# EAGLE schematic Dawing Machine Rev 1 (EAGLE 6.4)
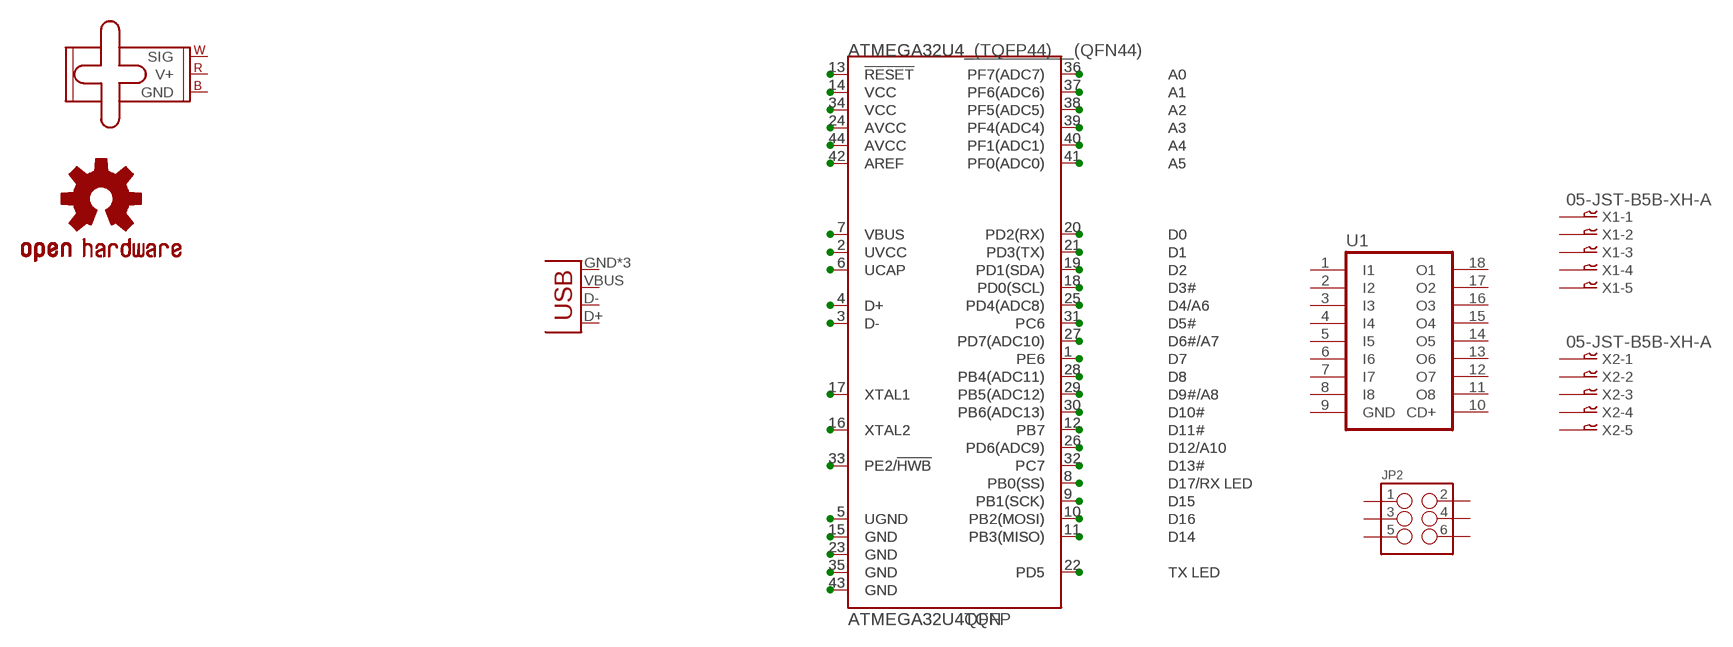
[diagram p0: schematic, sheet 1]

## Parts
ATMEGA32U4_(TQFP44)  ATMEGA32U4TQFP  [SPARKFUN-DIGITALIC_TQFP44]
ATMEGA32U4___________(QFN44)  ATMEGA32U4QFN  [SPARKFUN-DIGITALIC_QFN-44]
JP1  USB-MICROB  [USB-MICROB]
JP2  M03X2SMT  [2X3_SMT_POSTS]
LOGO1  OSHW-LOGOS  [OSHW-LOGO-S]
M1  SMALL_SERVO  [1X03]
U1  ULN2803AFW  [SO18W]
X1  05-JST-B5B-XH-A  [B5B-XH]
X2  05-JST-B5B-XH-A  [B5B-XH]

## Nets
N$1: ATMEGA32U4_(TQFP44).13(!RESET) ATMEGA32U4___________(QFN44).13(!RESET)
N$2: ATMEGA32U4_(TQFP44).42(AREF) ATMEGA32U4___________(QFN44).42(AREF)
N$3: ATMEGA32U4_(TQFP44).24(AVCC) ATMEGA32U4___________(QFN44).24(AVCC)
N$4: ATMEGA32U4_(TQFP44).44(AVCC) ATMEGA32U4___________(QFN44).44(AVCC)
N$5: ATMEGA32U4_(TQFP44).4(D+) ATMEGA32U4___________(QFN44).4(D+)
N$6: ATMEGA32U4_(TQFP44).3(D-) ATMEGA32U4___________(QFN44).3(D-)
N$7: ATMEGA32U4_(TQFP44).15(GND) ATMEGA32U4___________(QFN44).15(GND)
N$8: ATMEGA32U4_(TQFP44).23(GND) ATMEGA32U4___________(QFN44).23(GND)
N$9: ATMEGA32U4_(TQFP44).35(GND) ATMEGA32U4___________(QFN44).35(GND)
N$10: ATMEGA32U4_(TQFP44).43(GND) ATMEGA32U4___________(QFN44).43(GND)
N$11: ATMEGA32U4_(TQFP44).8(PB0(SS)) ATMEGA32U4___________(QFN44).8(PB0(SS))
N$12: ATMEGA32U4_(TQFP44).9(PB1(SCK)) ATMEGA32U4___________(QFN44).9(PB1(SCK))
N$13: ATMEGA32U4_(TQFP44).10(PB2(MOSI)) ATMEGA32U4___________(QFN44).10(PB2(MOSI))
N$14: ATMEGA32U4_(TQFP44).11(PB3(MISO)) ATMEGA32U4___________(QFN44).11(PB3(MISO))
N$15: ATMEGA32U4_(TQFP44).28(PB4(ADC11)) ATMEGA32U4___________(QFN44).28(PB4(ADC11))
N$16: ATMEGA32U4_(TQFP44).29(PB5(ADC12)) ATMEGA32U4___________(QFN44).29(PB5(ADC12))
N$17: ATMEGA32U4_(TQFP44).30(PB6(ADC13)) ATMEGA32U4___________(QFN44).30(PB6(ADC13))
N$18: ATMEGA32U4_(TQFP44).12(PB7) ATMEGA32U4___________(QFN44).12(PB7)
N$19: ATMEGA32U4_(TQFP44).31(PC6) ATMEGA32U4___________(QFN44).31(PC6)
N$20: ATMEGA32U4_(TQFP44).32(PC7) ATMEGA32U4___________(QFN44).32(PC7)
N$21: ATMEGA32U4_(TQFP44).18(PD0(SCL)) ATMEGA32U4___________(QFN44).18(PD0(SCL))
N$22: ATMEGA32U4_(TQFP44).19(PD1(SDA)) ATMEGA32U4___________(QFN44).19(PD1(SDA))
N$23: ATMEGA32U4_(TQFP44).20(PD2(RX)) ATMEGA32U4___________(QFN44).20(PD2(RX))
N$24: ATMEGA32U4_(TQFP44).21(PD3(TX)) ATMEGA32U4___________(QFN44).21(PD3(TX))
N$25: ATMEGA32U4_(TQFP44).25(PD4(ADC8)) ATMEGA32U4___________(QFN44).25(PD4(ADC8))
N$26: ATMEGA32U4_(TQFP44).22(PD5) ATMEGA32U4___________(QFN44).22(PD5)
N$27: ATMEGA32U4_(TQFP44).26(PD6(ADC9)) ATMEGA32U4___________(QFN44).26(PD6(ADC9))
N$28: ATMEGA32U4_(TQFP44).27(PD7(ADC10)) ATMEGA32U4___________(QFN44).27(PD7(ADC10))
N$29: ATMEGA32U4_(TQFP44).33(PE2/!HWB) ATMEGA32U4___________(QFN44).33(PE2/!HWB)
N$30: ATMEGA32U4_(TQFP44).1(PE6) ATMEGA32U4___________(QFN44).1(PE6)
N$31: ATMEGA32U4_(TQFP44).41(PF0(ADC0)) ATMEGA32U4___________(QFN44).41(PF0(ADC0))
N$32: ATMEGA32U4_(TQFP44).40(PF1(ADC1)) ATMEGA32U4___________(QFN44).40(PF1(ADC1))
N$33: ATMEGA32U4_(TQFP44).39(PF4(ADC4)) ATMEGA32U4___________(QFN44).39(PF4(ADC4))
N$34: ATMEGA32U4_(TQFP44).38(PF5(ADC5)) ATMEGA32U4___________(QFN44).38(PF5(ADC5))
N$35: ATMEGA32U4_(TQFP44).37(PF6(ADC6)) ATMEGA32U4___________(QFN44).37(PF6(ADC6))
N$36: ATMEGA32U4_(TQFP44).36(PF7(ADC7)) ATMEGA32U4___________(QFN44).36(PF7(ADC7))
N$37: ATMEGA32U4_(TQFP44).6(UCAP) ATMEGA32U4___________(QFN44).6(UCAP)
N$38: ATMEGA32U4_(TQFP44).5(UGND) ATMEGA32U4___________(QFN44).5(UGND)
N$39: ATMEGA32U4_(TQFP44).2(UVCC) ATMEGA32U4___________(QFN44).2(UVCC)
N$40: ATMEGA32U4_(TQFP44).7(VBUS) ATMEGA32U4___________(QFN44).7(VBUS)
N$41: ATMEGA32U4_(TQFP44).14(VCC) ATMEGA32U4___________(QFN44).14(VCC)
N$42: ATMEGA32U4_(TQFP44).34(VCC) ATMEGA32U4___________(QFN44).34(VCC)
N$43: ATMEGA32U4_(TQFP44).17(XTAL1) ATMEGA32U4___________(QFN44).17(XTAL1)
N$44: ATMEGA32U4_(TQFP44).16(XTAL2) ATMEGA32U4___________(QFN44).16(XTAL2)
Unconnected: JP1.D+ JP1.D- JP1.GND JP1.MT1(GND) JP1.MT2(GND) JP1.VBUS JP2.1 JP2.2 JP2.3 JP2.4 JP2.5 JP2.6 M1.1(SIG) M1.2(V+) M1.3(GND) U1.1(I1) U1.2(I2) U1.3(I3) U1.4(I4) U1.5(I5) U1.6(I6) U1.7(I7) U1.8(I8) U1.10(CD+) U1.11(O8) U1.12(O7) U1.13(O6) U1.14(O5) U1.15(O4) U1.16(O3) U1.17(O2) U1.18(O1) X1.P$1 X1.P$2 X1.P$3 X1.P$4 X1.P$5 X2.P$1 X2.P$2 X2.P$3 X2.P$4 X2.P$5

## Power pins joined to a net without a drawn wire
GND: U1.9(GND)

## Library data of the parts
ATMEGA32U4_(TQFP44) ATMEGA32U4___________(QFN44) = SparkFun-DigitalIC:ATMEGA32U4: Atmel 44-pin 8-bit Microcontroller with 32KBytes of ISP Flash and USB Controller ----- Please use the QFN-44-NOPAD_1:1 package for the footprint of all boards using a 32U4. Route traces directly away from the pads as much as possible.
JP1 = SparkFun-Connectors:USB: USB Connectors USB-B-PTH is fully proven SKU : PRT-00139/CONN-08278 USB-miniB is fully proven SKU : PRT-00587 USB-A-PCB is untested. USB-A-H is throughly reviewed, but untested. Spark Fun Electronics SKU : PRT-00437 USB-B-SMT is throughly reviewed, but untested. Needs silkscreen touching up. USB-A-S has not been used/tested USB-MB-H has not been used/tested USB-MICROB has been used. CONN-09505; PROD_ID: CONN-09505
JP2 = SparkFun-Connectors:M03X2: 2x3 .1" header. Shrouded, with keying- CONN-10681 SMT- CONN-11415 Pogo pins- HW-11044; PROD_ID: CONN-11415
LOGO1 = SparkFun-Aesthetics:OSHW-LOGO: Open Source Hardware Logo This logo indicates the piece of hardware it is found on incorporates a OSHW license and/or adheres to the definition of open source hardware found here: http://freedomdefined.org/OSHW
M1 = SparkFun-Electromechanical:SMALL_SERVO: Small servo motor This is the small servo used in the SIK. SKU: ROB-09065
U1 = uln-udn:ULN2803A: DRIVER ARRAY
X1 X2 = con-jst-xh:05-JST: JST CONNECTOR